# EAGLE schematic stepper cape (EAGLE 6.2)
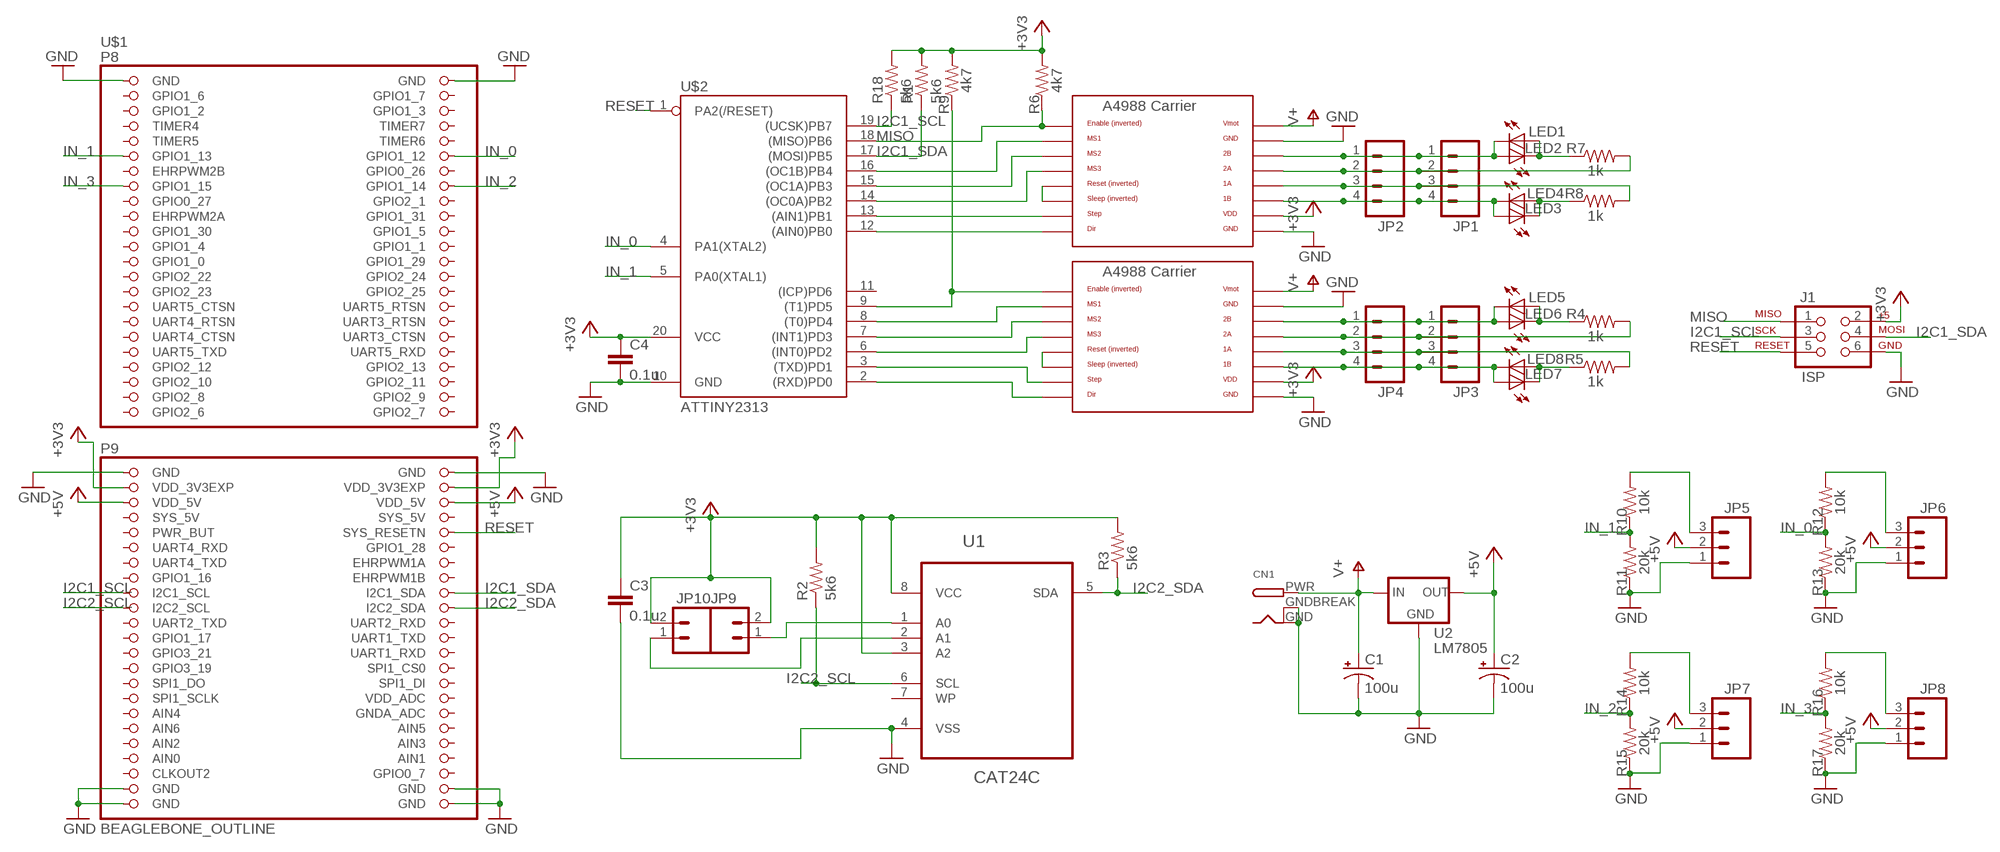
[diagram p0: schematic, sheet 1]

## Parts
C1  100u  CPOL-USE2.5-6  [E2,5-6]
C2  100u  CPOL-USE2.5-6  [E2,5-6]
C3  0.1u  CAP0805  [0805]
C4  0.1u  CAP0805  [0805]
CN1  DCBARRELPTH  [DCJACK_2MM_PTH]
J1  ISP  AVR_SPI_PRG_6PTH  [2X3]
JP1  M04SCREW  [SCREWTERMINAL-3.5MM-4]
JP2  M04PTH  [1X04]
JP3  M04SCREW  [SCREWTERMINAL-3.5MM-4]
JP4  M04PTH  [1X04]
JP5  M03PTH  [1X03]
JP6  M03PTH  [1X03]
JP7  M03PTH  [1X03]
JP8  M03PTH  [1X03]
JP9  M02PTH  [1X02]
JP10  M02PTH  [1X02]
LED1  LEDCHIPLED_1206  [CHIPLED_1206]
LED2  LEDCHIPLED_1206  [CHIPLED_1206]
LED3  LEDCHIPLED_1206  [CHIPLED_1206]
LED4  LEDCHIPLED_1206  [CHIPLED_1206]
LED5  LEDCHIPLED_1206  [CHIPLED_1206]
LED6  LEDCHIPLED_1206  [CHIPLED_1206]
LED7  LEDCHIPLED_1206  [CHIPLED_1206]
LED8  LEDCHIPLED_1206  [CHIPLED_1206]
R1  5k6  R-US_R0805  [R0805]
R2  5k6  R-US_R0805  [R0805]
R3  5k6  R-US_R0805  [R0805]
R4  1k  R-US_R0805  [R0805]
R5  1k  R-US_R0805  [R0805]
R6  4k7  R-US_R0805  [R0805]
R7  1k  R-US_R0805  [R0805]
R8  1k  R-US_R0805  [R0805]
R9  4k7  R-US_R0805  [R0805]
R10  10k  R-US_R0805  [R0805]
R11  20k  R-US_R0805  [R0805]
R12  10k  R-US_R0805  [R0805]
R13  20k  R-US_R0805  [R0805]
R14  10k  R-US_R0805  [R0805]
R15  20k  R-US_R0805  [R0805]
R16  10k  R-US_R0805  [R0805]
R17  20k  R-US_R0805  [R0805]
R18  5k6  R-US_R0805  [R0805]
U1  CAT24C  CAT24C256WI-GT3  [SOIC127P600X175-8N]
U2  LM7805  V_REG_78XXSINK  [TO220-IGO]
U$1  BEAGLEBONE_OUTLINE  [BEAGLEBONE_SHIELD]
U$2  ATTINY2313  TINY2313-*S*  [SO20L$]
X  A4988BREAKOUT  [A4988BREAKOUT]
X1  A4988BREAKOUT  [A4988BREAKOUT]

## Nets
+3V3: C3.1 C4.1 J1.2 JP9.2 JP10.2 R1.2 R2.2 R3.2 R6.2 R9.2 R18.2 U1.3(A2) U1.8(VCC) U$1.49(VDD_3V3EXP) U$1.50(VDD_3V3EXP) U$2.20(VCC) X1.VDD X.VDD
+5V: C2.+ JP5.2 JP6.2 JP7.2 JP8.2 U2.OUT U$1.51(VDD_5V) U$1.52(VDD_5V)
GND: C1.- C2.- C3.2 C4.2 CN1.GND CN1.GNDBREAK J1.6 JP5.1 JP6.1 JP7.1 JP8.1 R11.1 R13.1 R15.1 R17.1 U1.4(VSS) U2.GND U$1.1(GND) U$1.2(GND) U$1.47(GND) U$1.48(GND) U$1.89(GND) U$1.90(GND) U$1.91(GND) U$1.92(GND) U$2.10(GND) X1.GND X1.GND@0(GND) X.GND X.GND@0(GND)
I2C1_SCL: J1.3 R18.1 U$1.63(I2C1_SCL) U$2.19((UCSK)PB7)
I2C1_SDA: J1.4 R1.1 U$1.64(I2C1_SDA) U$2.17((MOSI)PB5)
I2C2_SCL: R2.1 U1.6(SCL) U$1.65(I2C2_SCL)
I2C2_SDA: R3.1 U1.5(SDA) U$1.66(I2C2_SDA)
IN_0: R12.1 R13.2 U$1.12(GPIO1_12) U$2.4(PA1(XTAL2))
IN_1: R10.1 R11.2 U$1.11(GPIO1_13) U$2.5(PA0(XTAL1))
IN_2: R14.1 R15.2 U$1.16(GPIO1_14)
IN_3: R16.1 R17.2 U$1.15(GPIO1_15)
MISO: J1.1 R6.1 U$2.18((MISO)PB6) X.EN
N$1: JP9.1 U1.1(A0)
N$2: U$2.2((RXD)PD0) X1.DIR
N$3: JP10.1 U1.2(A1)
N$4: U$2.3((TXD)PD1) X1.STEP
N$5: JP1.1 JP2.1 LED1.C LED2.A X.2B
N$6: U$2.6((INT0)PD2) X1.MS3
N$7: U$2.7((INT1)PD3) X1.MS2
N$8: U$2.8((T0)PD4) X1.MS1
N$9: X1.RST X1.SLP(SLEEP)
N$10: JP3.1 JP4.1 LED5.C LED6.A X1.2B
N$11: JP3.2 JP4.2 R4.2 X1.2A
N$12: X.RST X.SLP(SLEEP)
N$13: JP1.2 JP2.2 R7.2 X.2A
N$14: JP1.3 JP2.3 R8.2 X.1A
N$15: JP1.4 JP2.4 LED3.A LED4.C X.1B
N$16: LED1.A LED2.C R7.1
N$17: JP3.3 JP4.3 R5.2 X1.1A
N$18: LED3.C LED4.A R8.1
N$19: JP3.4 JP4.4 LED7.A LED8.C X1.1B
N$20: LED5.A LED6.C R4.1
N$21: LED7.C LED8.A R5.1
N$22: R9.1 U$2.9((T1)PD5) X1.EN
N$23: U$2.12((AIN0)PB0) X.DIR
N$24: U$2.13((AIN1)PB1) X.STEP
N$25: JP6.3 R12.2
N$26: JP5.3 R10.2
N$27: JP7.3 R14.2
N$28: JP8.3 R16.2
N$29: U$2.14((OC0A)PB2) X.MS3
N$30: U$2.15((OC1A)PB3) X.MS2
N$31: U$2.16((OC1B)PB4) X.MS1
RESET: J1.5 U$1.56(SYS_RESETN) U$2.1(PA2(/RESET))
V+: C1.+ CN1.PWR U2.IN X1.VMOT X.VMOT
Unconnected: U1.7(WP) U$1.5(GPIO1_2) U$1.6(GPIO1_3) U$1.7(TIMER4) U$1.8(TIMER7) U$1.9(TIMER5) U$1.10(TIMER6) U$1.13(EHRPWM2B) U$1.14(GPIO0_26) U$1.17(GPIO0_27) U$1.18(GPIO2_1) U$1.19(EHRPWM2A) U$1.20(GPIO1_31) U$1.21(GPIO1_30) U$1.22(GPIO1_5) U$1.23(GPIO1_4) U$1.24(GPIO1_1) U$1.25(GPIO1_0) U$1.26(GPIO1_29) U$1.27(GPIO2_22) U$1.28(GPIO2_24) U$1.29(GPIO2_23) U$1.30(GPIO2_25) U$1.31(UART5_CTSN) U$1.32(UART5_RTSN) U$1.33(UART4_RTSN) U$1.34(UART3_RTSN) U$1.35(UART4_CTSN) U$1.36(UART3_CTSN) U$1.37(UART5_TXD) U$1.38(UART5_RXD) U$1.39(GPIO2_12) U$1.40(GPIO2_13) U$1.41(GPIO2_10) U$1.53(SYS_5V) U$1.54(SYS_5V) U$1.55(PWR_BUT) U$1.57(UART4_RXD) U$1.58(GPIO1_28) U$1.59(UART4_TXD) U$1.60(EHRPWM1A) U$1.61(GPIO1_16) U$1.62(EHRPWM1B) U$1.67(UART2_TXD) U$1.68(UART2_RXD) U$1.69(GPIO1_17) U$1.70(UART1_TXD) U$1.71(GPIO3_21) U$1.72(UART1_RXD) U$1.73(GPIO3_19) U$1.74(SPI1_CS0) U$1.75(SPI1_DO) U$1.76(SPI1_DI) U$1.77(SPI1_SCLK) U$1.78(VDD_ADC) U$1.79(AIN4) U$1.80(GNDA_ADC) U$1.81(AIN6) U$1.82(AIN5) U$1.83(AIN2) U$1.86(AIN1) U$1.87(CLKOUT2) U$1.88(GPIO0_7) U$2.11((ICP)PD6)

## Power pins joined to a net without a drawn wire
AIN0: U$1.85(AIN0)
AIN3: U$1.84(AIN3)
GPIO1_6: U$1.3(GPIO1_6)
GPIO1_7: U$1.4(GPIO1_7)
GPIO2_6: U$1.45(GPIO2_6)
GPIO2_7: U$1.46(GPIO2_7)
GPIO2_8: U$1.43(GPIO2_8)
GPIO2_9: U$1.44(GPIO2_9)
GPIO2_11: U$1.42(GPIO2_11)

## Library data of the parts
C1 C2 = adafruit:CPOL-US: POLARIZED CAPACITOR, American symbol
C3 C4 = SparkFun-Passives:CAP: Capacitor Standard 0603 ceramic capacitor, and 0.1" leaded capacitor.
CN1 = adafruit:DCBARREL: 2.0mm DC Barrel Jack DCJACK_2MM_PTH - Through Hole Jack (4UConnector: 05537)
J1 = SparkFun-Connectors:AVR_SPI_PRG_6: AVR ISP 6 Pin This is the reduced ISP connector for AVR programming. Common on Arduino. This footprint will take up less PCB space and can be used with a 10-pin to 6-pin adapter such as SKU: BOB-08508
JP1-JP4 = SparkFun-Connectors:M04: Header 4 Standard 4-pin 0.1" header. Use with straight break away headers (SKU : PRT-00116), right angle break away headers (PRT-00553), swiss pins (PRT-00743), machine pins (PRT-00117), and female headers (PRT-00115). Molex polarized connector foot print use with SKU : PRT-08231 with associated crimp pins and housings. 1MM SMD Version SKU: PRT-10208
JP5-JP8 = SparkFun-Connectors:M03: Header 3 Standard 3-pin 0.1" header. Use with straight break away headers (SKU : PRT-00116), right angle break away headers (PRT-00553), swiss pins (PRT-00743), machine pins (PRT-00117), and female headers (PRT-00115). Molex polarized connector foot print use with SKU : PRT-08232 with associated crimp pins and housings.
JP9 JP10 = SparkFun-Connectors:M02: Header 2 Standard 2-pin 0.1" header. Use with straight break away headers (SKU : PRT-00116), right angle break away headers (PRT-00553), swiss pins (PRT-00743), machine pins (PRT-00117), and female headers (PRT-00115). Molex polarized connector foot print use with SKU : PRT-08233 with associated crimp pins and housings.
LED1-LED8 = adafruit:LED: LED OSRAM: - CHIPLED LG R971, LG N971, LY N971, LG Q971, LY Q971, LO R971, LY R971 LH N974, LH R974 LS Q976, LO Q976, LY Q976 LO Q996 - Hyper CHIPLED LW Q18S LB Q993, LB Q99A, LB R99A - SideLED LS A670, LO A670, LY A670, LG A670, LP A670 LB A673, LV A673, LT A673, LW A673 LH A674 LY A675 LS A676, LA A676, LO A676, LY A676, LW A676 LS A679, LY A679, LG A679 - Hyper Micro SIDELED® LS Y876, LA Y876, LO Y876, LY Y876 LT Y87S - SmartLED LW L88C, LW L88S LB L89C, LB L89S, LG L890 LS L89K, LO L89K, LY L89K LS L896, LA L896, LO L896, LY L896 - TOPLED LS T670, LO T670, LY T670, LG T670, LP T670 LSG T670, LSP T670, LSY T670, LOP T670, LYG T670 LG T671, LOG T671, LSG T671 LB T673, LV T673, LT T673, LW T673 LH T674 LS T676, LA T676, LO T676, LY T676, LB T676, LH T676, LSB T676, LW T676 LB T67C, LV T67C, LT T67C, LS T67K, LO T67K, LY T67K, LW E67C LS E67B, LA E67B, LO E67B, LY E67B, LB E67C, LV E67C, LT E67C LW T67C LS T679, LY T679, LG T679 LS T770, LO T770, LY T770, LG T770, LP T770 LB T773, LV T773, LT T773, LW T773 LH T774 LS E675, LA E675, LY E675, LS T675 LS T776, LA T776, LO T776, LY T776, LB T776 LHGB T686 LT T68C, LB T68C - Hyper Mini TOPLED® LB M676 - Mini TOPLED Santana® LG M470 LS M47K, LO M47K, LY M47K Source: http://www.osram.convergy.de/
R1-R18 = adafruit:R-US_: RESISTOR, American symbol
U1 = CAT24C256W:CAT24C256WI-GT3: 256-Kb I2C CMOS Serial EEPROM; MPN: CAT24C256WI-GT3; OC_FARNELL: 1718127; OC_NEWARK: 08R5412; PACKAGE: SOIC-8; SUPPLIER: CATALYST SEMICONDUCTOR
U2 = SparkFun-PowerIC:V_REG_78XX: Voltage Regulator Standard 7805 5V regulator. IGO (Input Ground Output). Spark Fun Electronics SKU : COM-00107
U$1 = adafruit:BEAGLEBONE_OUTLINE: Should match A3 pinout - but not completely tested
U$2 = avr-7:TINY2313*: Atmel Tiny2313 2K Flash, 128 bytes EEPROM, 128 bytes RAM
X X1 = RepRapjr:A4988BREAKOUT